# Altium schematic sheet tx.SchDoc
size A4
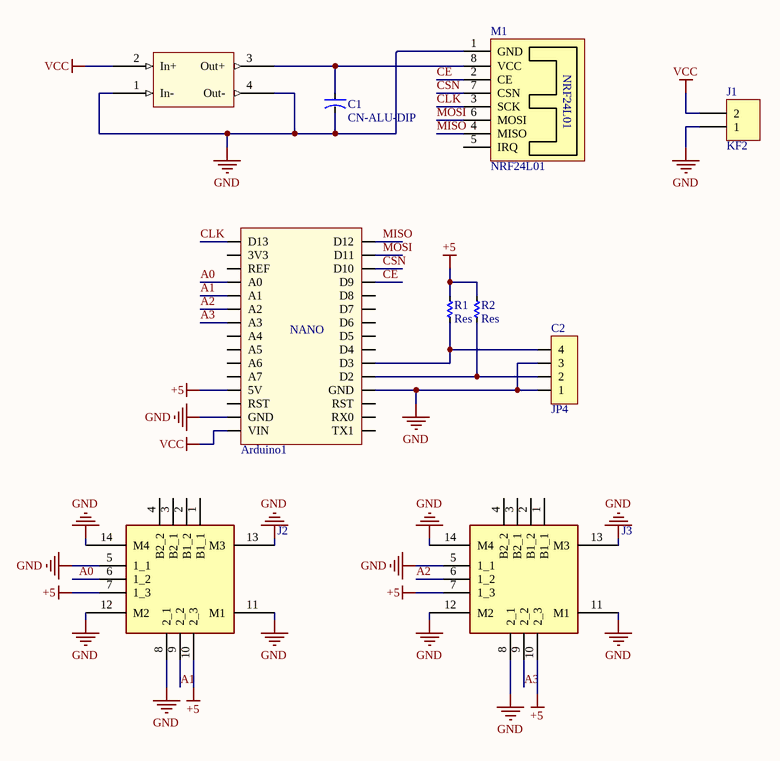
[diagram p0: tx.SchDoc]

## Parts
Arduino1  Arduino Nano  [Arduino Nano]  (value not drawn)
C1  CN-ALU-DIP  [CA-ALU-6.3]
C2  JP4  [JP4-C1T]
J1  KF2  [KF2-5.08]
J2  RKJXV1224005  [RKJXV1224005]  (value not drawn)
J3  RKJXV1224005  [RKJXV1224005]  (value not drawn)
M1  NRF24L01  [NRF24L01]
MP1  MP2307 DC-DC Switching Buck Step-Down Module  [Mini360]  (value not drawn)
R1  Res  [RES-SMD-1206]
R2  Res  [RES-SMD-1206]

## Nets
+5: Arduino1.5V J2.7(1_3) J2.10(2_3) J3.7(1_3) J3.10(2_3) R1.1 R2.1
GND: Arduino1.GND C1.2 C2.1 C2.3 J1.1 J2.5(1_1) J2.8(2_1) J2.11(M1) J2.12(M2) J2.13(M3) J2.14(M4) J3.5(1_1) J3.8(2_1) J3.11(M1) J3.12(M2) J3.13(M3) J3.14(M4) M1.1(GND) MP1.1(In-) MP1.4(Out-)
VCC: Arduino1.VIN J1.2 MP1.2(In+)
A0: Arduino1.A0 J2.6(1_2)
A1: Arduino1.A1 J2.9(2_2)
A2: Arduino1.A2 J3.6(1_2)
A3: Arduino1.A3 J3.9(2_2)
CE: Arduino1.D9 M1.2(CE)
CLK: Arduino1.D13 M1.3(SCK)
CSN: Arduino1.D10 M1.7(CSN)
MISO: Arduino1.D12 M1.4(MISO)
MOSI: Arduino1.D11 M1.6(MOSI)
NetArduino1_D2: Arduino1.D2 C2.2 R2.2
NetArduino1_D3: Arduino1.D3 C2.4 R1.2
NetC1_1: C1.1 M1.8(VCC) MP1.3(Out+)

Not connected (* = marked no-connect by the designer): Arduino1 3V3 A4 A5 A6 A7 D4 D5 D6 D7 D8 REF RST RX0 TX1; J2 1(B1_1) 2(B1_2) 3(B2_1) 4(B2_2); J3 1(B1_1) 2(B1_2) 3(B2_1) 4(B2_2); M1 5(IRQ)

## Notes on the sheet
- (in symbol Arduino Nano) NANO

## Library data of the parts
Arduino1 = Arduino Nano: Value: Cau 1A
C1 = CN-ALU-DIP: Capacitor (Semiconductor SIM Model); Value: 104; LatestRevisionDate: 17-Jul-2002; LatestRevisionNote: Re-released for DXP Platform.; PackageReference: C1206; Publisher: Altium Limited
C2 = JP4: WR-PHD 2.54 mm Angled Socket Header; Manufacturer: W¨¹rth Elektronik eiSos GmbH; partNo: 613004143121; ComponentLink1 Description: Manufacturer; ComponentLink2 Description: Datasheet; NoPins: 04; Created Date: 29 March 2013; ComponentLink1URL: http://www.we-online.com; ComponentLink2URL: http://katalog.we-online.de/em/datasheet/6130xx143121.pdf; Created by: Karrer Zheng
J1 = KF2: Manufacturer: Würth Elektronik eiSos GmbH; partNo: 691103110002; ComponentLink1 Description: Manufacturer; ComponentLink2 Description: Datasheet; NoPins: 2; Created Date: 29 October 2013; ComponentLink1URL: http://www.we-online.com; ComponentLink2URL: http://katalog.we-online.de/em/datasheet/6911031100xx.pdf; Created by: Karrer Zheng
J2 J3 = RKJXV1224005: Joystick; Manufacturer_Name: ALPS; Datasheet Link: http://www.alps.com/prod/info/E/HTML/MultiControl/Potentiometer/RKJXK/RKJXV1224005.html; Manufacturer_Part_Number: RKJXV1224005; Mouser Part Number: 688-RKJXV1224005; Mouser Price/Stock: https://www.mouser.com/Search/Refine.aspx?Keyword=688-RKJXV1224005; RS Part Number: 1239578; RS Price/Stock: http://uk.rs-online.com/web/p/products/1239578
MP1 = MP2307 Module
R1 R2 = Res-SMD: Resistor; Manufacturer: Generic Components; Class: Passive; Published: 08/06/2000; Publisher: Altium Hobart Technology Centre